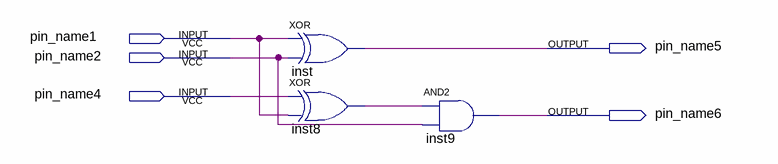
[diagram p0: schematic sheet]
// Quartus schematic somador.bdf as structural Verilog: 3 symbols, 5 pins
module somador (
  input  pin_name1,
  input  pin_name2,
  input  pin_name4,
  output pin_name5,
  output pin_name6
);

  wire inst8_out;

  xor inst (pin_name5, pin_name1, pin_name2);
  xor inst8 (inst8_out, pin_name4, pin_name1);
  and inst9 (pin_name6, inst8_out, pin_name2);
endmodule
